# EAGLE design Example (EAGLE 9.5.2)
REVISION: 1.0; SCH_DESC: An Example Schematic; TEAM: Example_Team_Number
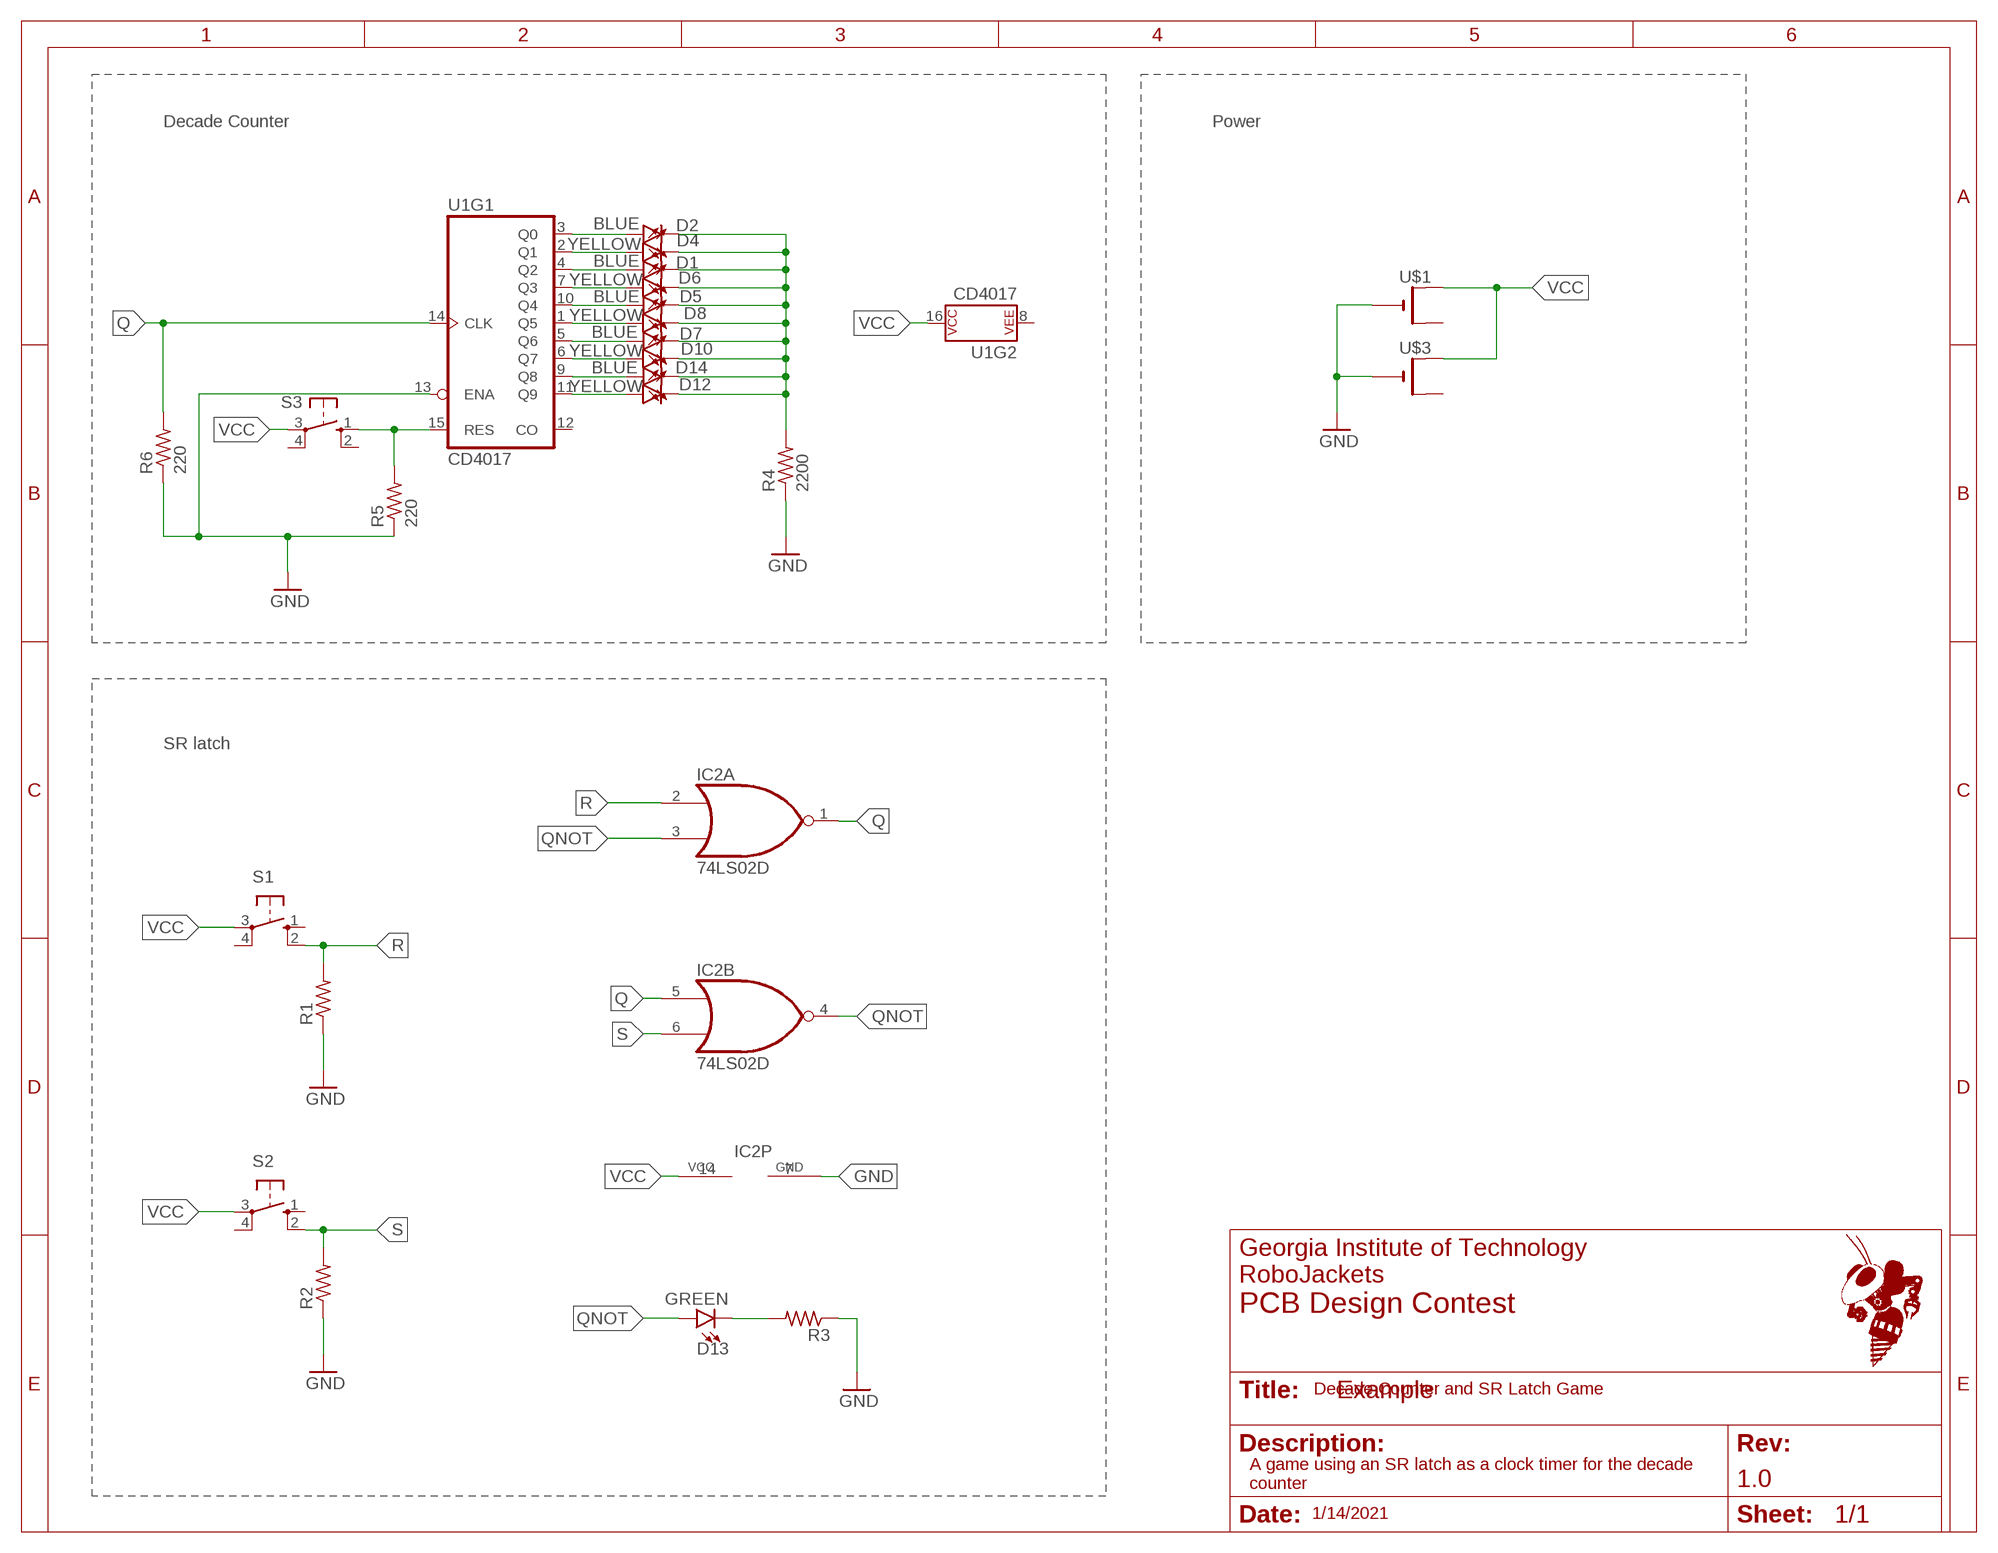
[diagram p0: schematic, sheet 1]
FRAME2 (FRAME_A_L): REVISION: 1.0; SCH_DESC: 555 Timer Motor Driver Circuit; TEAM: PCB Design Contest

## Parts
D1  BLUE  LED-BLUE0603  [LED-0603]
D2  BLUE  LED-BLUE0603  [LED-0603]
D4  YELLOW  LED-SMD-YELLOW  [LED0603]
D5  BLUE  LED-BLUE0603  [LED-0603]
D6  YELLOW  LED-SMD-YELLOW  [LED0603]
D7  BLUE  LED-BLUE0603  [LED-0603]
D8  YELLOW  LED-SMD-YELLOW  [LED0603]
D10  YELLOW  LED-SMD-YELLOW  [LED0603]
D12  YELLOW  LED-SMD-YELLOW  [LED0603]
D13  GREEN  LED-GREEN0603  [LED-0603]
D14  BLUE  LED-BLUE0603  [LED-0603]
IC2  74LS02D  [SO14]
R1  R-US_R0603  [R0603]
R2  R-US_R0603  [R0603]
R3  R-US_R0603  [R0603]
R4  2200  R-US_R0603  [R0603]
R5  220  R-US_R0603  [R0603]
R6  220  R-US_R0603  [R0603]
S1  40-XX-ROUND  [B3F-40XX-ROUND]
S2  40-XX-ROUND  [B3F-40XX-ROUND]
S3  40-XX-ROUND  [B3F-40XX-ROUND]
U1  CD4017  [DIP16]
U$1  CR1220SMT  [CR1220-SMD]
U$3  CR1220SMT  [CR1220-SMD]

## Nets
GND: IC2.7(P:GND) R1.1 R2.1 R3.1 R4.1 R5.1 R6.1 U1.13(ENA) U$1.- U$3.-
N$1: S3.3(P)
N$2: D13.A
N$3: R5.2 S3.1(S) U1.15(RES)
N$5: D13.C R3.2
N$10: D2.A U1.3(Q0)
N$11: D4.A U1.2(Q1)
N$12: D1.A U1.4(Q2)
N$13: D6.A U1.7(Q3)
N$14: D5.A U1.10(Q4)
N$15: D8.A U1.1(Q5)
N$16: D7.A U1.5(Q6)
N$17: D10.A U1.6(Q7)
N$18: D14.A U1.9(Q8)
N$19: D12.A U1.11(Q9)
N$20: D1.C D2.C D4.C D5.C D6.C D7.C D8.C D10.C D12.C D14.C R4.2
Q: IC2.1(A:O) IC2.5(B:I0) R6.2 U1.14(CLK)
QNOT: IC2.3(A:I1) IC2.4(B:O)
R: IC2.2(A:I0) R1.2 S1.2(S1)
S: IC2.6(B:I1) R2.2 S2.2(S1)
VCC: IC2.14(P:VCC) S1.3(P) S2.3(P) U1.16(P$V+) U$1.+$1(+) U$3.+$1(+)
Unconnected: IC2.8(C:I0) IC2.9(C:I1) IC2.10(C:O) IC2.11(D:I0) IC2.12(D:I1) IC2.13(D:O) S1.1(S) S1.4(P1) S2.1(S) S2.4(P1) S3.2(S1) S3.4(P1) U1.8(P$V-) U1.12(CO) U$1.+$2(+1) U$3.+$2(+1)

## Notes on the sheet
- Decade Counter | Power
- SR latch
- Decade Counter and SR Latch Game
- A game using an SR latch as a clock timer for the decade 
  counter
- 1/14/2021

## Library data of the parts
D1 D2 D5 D7 D14 = RoboJackets-LEDs:LED-BLUE: Blue SMD LED Used in manufacturing of various products at SparkFun Packages: 0603 - SMD 0603 package [Product Link] <http://www.digikey.com/product-detail/en/SMLE12BC7TT86/511-1589-2-ND/1641808> 1206 - SMD1206 package [Product Link] <http://www.digikey.com/product-detail/en/lite-on-inc/LTST-C150TBKT/160-1643-1-ND/573584> SparkFun Products: ESP8266 Thing-Dev Board <https://www.sparkfun.com/products/13711> RedBoard <https://www.sparkfun.com/products/12757>; PROD_ID: DIO-08575
D4 D6 D8 D10 D12 = RoboJackets-LEDs:LED-SMD: Series of 0603 LEDs; DKPN: 160-1448-1-ND
D13 = RoboJackets-LEDs:LED-GREEN: Green SMD LED Used in manufacturing of various products at SparkFun Packages: 0603 - SMD 0603 package [Product Link] <http://www.futureelectronics.com/en/technologies/semiconductors/optoelectronics/leds/Pages/9894312-LTST-C190GKT.aspx?CrossPart=HSMG-C190&IM=0> LilyPad 1206 - SMD1206 LilyPad package [Product Link] <http://www.futureelectronics.com/en/Technologies/Product.aspx?ProductID=IN150NGHARVATEKCORPORATION2049943&IM=0> 1206 - SMD1206 package [Product Link] <http://www.futureelectronics.com/en/technologies/semiconductors/optoelectronics/leds/Pages/8315665-LTST-C150KGKT.aspx?IM=0> 1206 Bottom Mount -SMD 1206 Bottom Mount [Product Link] <http://www.digikey.com/product-detail/en/lite-on-inc/LTST-C230KGKT/160-1456-1-ND/386854> SparkFun Products: Pro Mini 328 -5V <https://www.sparkfun.com/products/821> RedBoard <https://www.sparkfun.com/products/12757> MP3 Trigger <https://www.sparkfun.com/products/13720> Makey Makey <https://www.sparkfun.com/products/11076>; PROD_ID: DIO-00821
IC2 = 74xx-us:74*02: Quad 2-input NOR gate; SPICEPREFIX: J
R1-R6 = rcl:R-US_: RESISTOR, American symbol; SPICEPREFIX: R
S1-S3 = adafruit:40-XX: OMRON SWITCH
U1 = SparkFun-IC-Logic:CD4017: 10-Out Decade Counter Datasheet <https://cdn.sparkfun.com/datasheets/Kits/cd4022b.pdf> SparkFun Products SparkFun SparkPunk Sequencer Kit <https://www.sparkfun.com/products/12707> (KIT-12707); PROD_ID: IC-11929
U$1 U$3 = adafruit:CR1220: CR1216/CR1220/CR1225 12mm 3V lithium coin cell Great for battery packup. Both SMT and THM holders. Note the THM package has the ground pads on both sides of the PCB so that the masks are the same - this reduces the cost

## Board
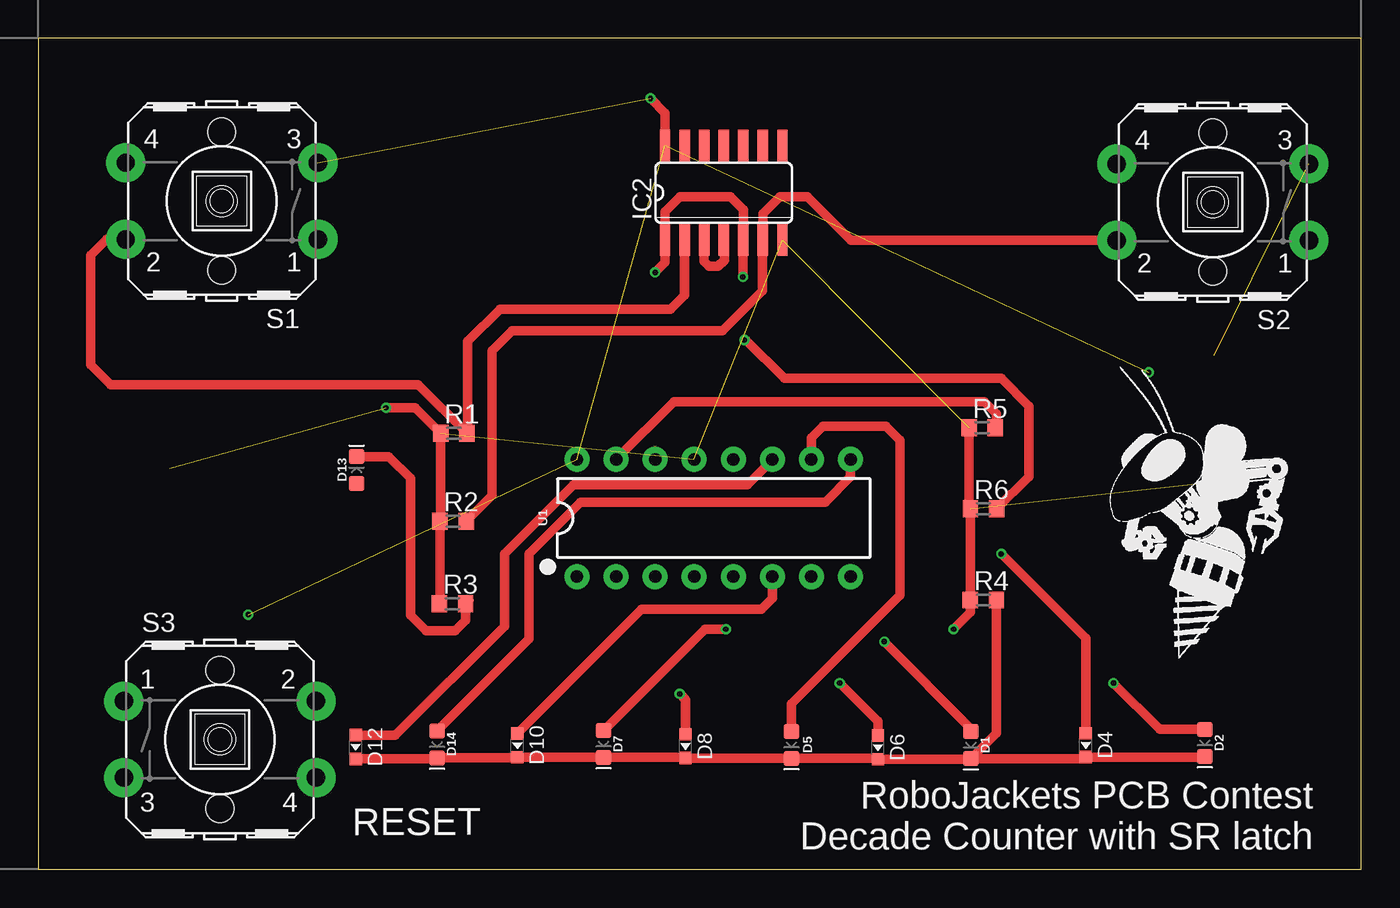
[diagram p1: board, top side]
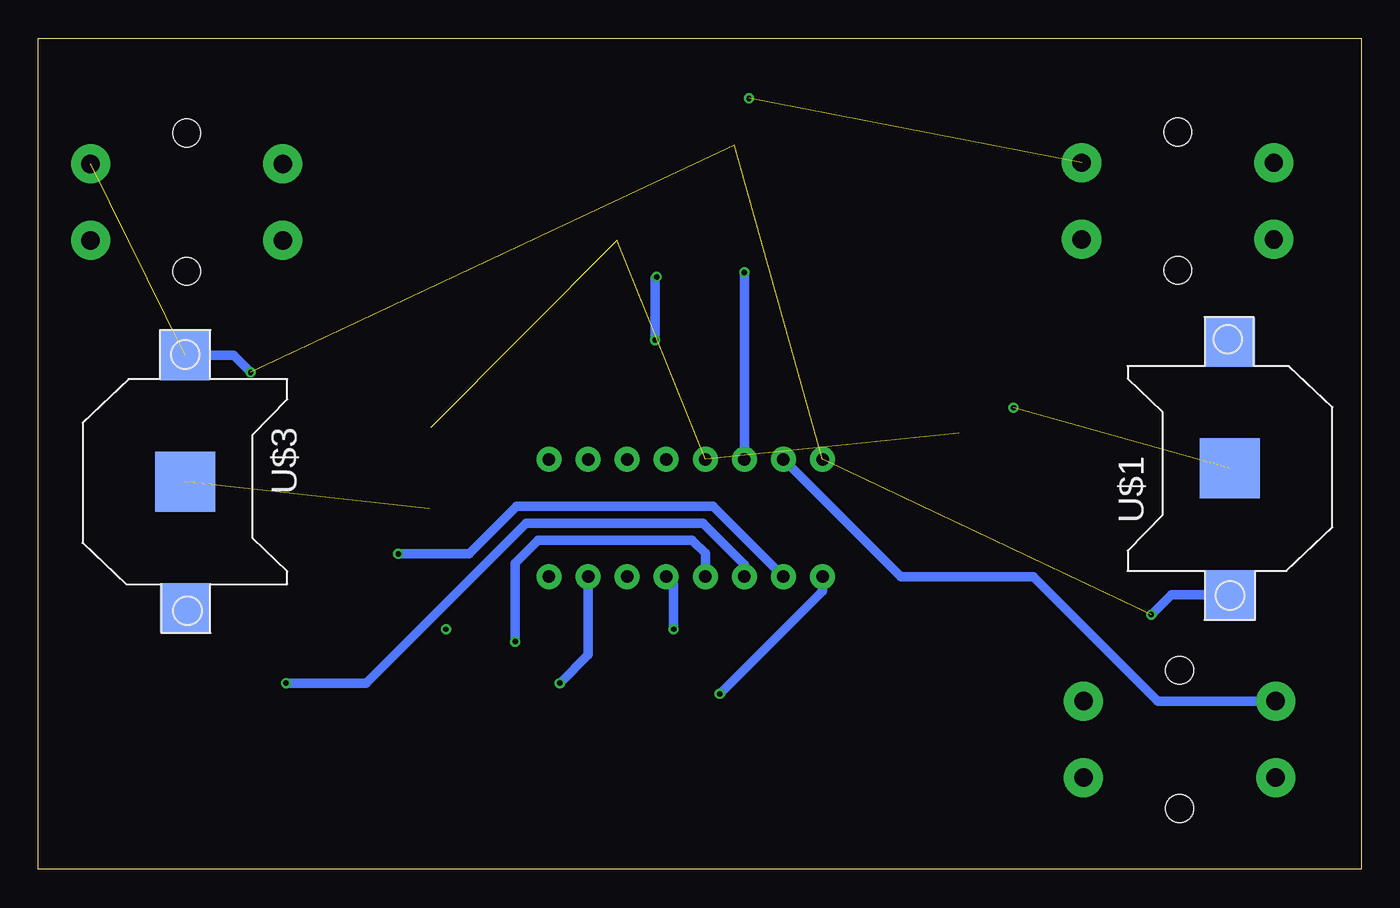
[diagram p2: board, bottom side, seen from below]

Size 86 x 54 mm. Coordinates in mm from the lower left corner, seen from the top.
Outline: 0,0 86,0 86,54 0,54 0,0
Copper layers (1*16): Top 0.035mm / dielectric 1.53mm / Bottom 0.035mm
Design rules "JLCPCB (2 Layer)": minimum track width 5mil, minimum drill 0.3mm, track to track 5mil, track to pad 5mil, pad to pad 5mil, via to via 20mil, smd to smd 5mil, copper to edge 0.2mm, drill to drill 21mil, minimum pad ring 6mil, minimum via ring 6mil, stop-mask expansion 0.05mm, vias tented up to drill 30mil, thermal gap 10mil

### Footprints (pad centres in the part's own frame; a part is rotated, then mirrored left to right if it is on the bottom)
LED-0603 = smd 1 x 1: A -0.877,0; C 0.877,0
LED0603 = smd 0.8 x 0.8: A -0.775,0; C 0.775,0
SO14 = smd 0.66 x 2.032: 1 -3.81,-3.073; 2 -2.54,-3.073; 3 -1.27,-3.073; 4 0,-3.073; 5 1.27,-3.073; 6 2.54,-3.073; 7 3.81,-3.073; 8 3.81,3.073; 9 2.54,3.073; 10 1.27,3.073; 11 0,3.073; 12 -1.27,3.073; 13 -2.54,3.073; 14 -3.81,3.073
R0603 = smd 1 x 1.1: 1 -0.85,0; 2 0.85,0
B3F-40XX-ROUND = drill 1.194 pad 2.54: 1 -6.248,2.489; 2 6.248,2.489; 3 -6.248,-2.489; 4 6.248,-2.489 | hole 1.803: 0,-4.496; 0,4.496
DIP16 = drill 0.813 pad 1.626: 1 -8.89,-3.81; 2 -6.35,-3.81; 3 -3.81,-3.81; 4 -1.27,-3.81; 5 1.27,-3.81; 6 3.81,-3.81; 7 6.35,-3.81; 8 8.89,-3.81; 9 8.89,3.81; 10 6.35,3.81; 11 3.81,3.81; 12 1.27,3.81; 13 -1.27,3.81; 14 -3.81,3.81; 15 -6.35,3.81; 16 -8.89,3.81
CR1220-SMD = smd 3.2 x 3.2: +$1 -8.2,0; +$2 8.2,0 | smd 3.9 x 3.9: - 0,0

### Placement (x,y rotation side)
D1  60.63,8.07 270 top
D2  75.84,8.21 270 top
D4  68.1,8.07 270 top
D5  48.96,8.08 270 top
D6  54.59,7.92 270 top
D7  36.75,8.14 270 top
D8  42.07,8 270 top
D10  31.14,8.05 270 top
D12  20.63,7.95 270 top
D13  20.69,25.95 90 top
D14  25.92,8.11 270 top
IC2  44.56,43.97 0 top
R1  27.01,28.34 0 top
R2  26.96,22.63 0 top
R3  26.92,17.27 0 top
R4  61.44,17.5 0 top
R5  61.36,28.69 0 top
R6  61.45,23.42 0 top
S1  11.92,43.43 180 top
S2  76.36,43.36 180 top
S3  11.8,8.44 0 top
U1  43.91,22.83 0 top
U$1  8.52,26.05 90 bottom
U$3  76.47,25.2 270 bottom
U$4  [ROBOBUZZ_1.0X]  74.1,13.7 0 top

### Tracks (layer width: path | path; a pad name or v marks a point on that pad's centre or on a via)
GND  (via drill 0.35)  (5 unrouted)
  Top 0.152: 26.16,22.68 R2.1 | 26.11,17.31 R3.1 | 60.51,23.51 R6.1 | R4.1
  Top 0.61: 26.16,22.68 R1.1 24.5,30 v22.6,30 | R2.1 26.11,17.31 | R5.1 60.51,23.51 | R4.1 R6.1 | R4.1 60.59,16.69 v59.5,15.6
N$3
  Top 0.152: S3.1 5.52,10.9
  Top 0.61: U1.15 41.32,30.4 61.5,30.4 62.3,29.6 62.3,28.78 R5.2
  Bottom 0.61: U1.15 29.92,19 21.3,19 13.23,10.93 S3.1
N$5
  Top 0.61: 28,17.5 R3.2 27.77,16.17 27.1,15.5 25.2,15.5 24.2,16.5 24.2,25.4 22.77,26.83 D13.C
N$10  (via drill 0.35)
  Top 0.61: D2.A 72.91,9.09 v69.9,12.1
  Bottom 0.61: v69.9,12.1 64.7,12.1 54.3,22.5 42.8,22.5 40.1,19.8 U1.3
N$11  (via drill 0.35)
  Top 0.61: D4.A 68.1,15 v62.6,20.5
  Bottom 0.61: v62.6,20.5 58,20.5 54.9,23.6 42.14,23.6 U1.2
N$12  (via drill 0.35)
  Top 0.61: D1.A 60.63,9.15 55,14.78 v55,14.8
  Bottom 0.61: v55,14.8 55,19.9 53.5,21.4 43.5,21.4 42.64,20.54 U1.4
N$13  (via drill 0.35)
  Top 0.61: D6.A 54.59,9.61 v52.1,12.1
  Bottom 0.61: v52.1,12.1 50.26,13.94 U1.7
N$14
  Top 0.61: D5.A 48.96,10.76 56,17.8 56,27.9 55.1,28.8 51,28.8 50.26,28.06 U1.10
N$15  (via drill 0.35)
  Top 0.61: D8.A 42.07,11.03 v41.7,11.4
  Bottom 0.61: v41.7,11.4 35.02,18.08 U1.1
N$16  (via drill 0.35)
  Top 0.61: D7.A 43.33,15.6 v44.7,15.6
  Bottom 0.61: v44.7,15.6 44.7,18.54 U1.5
N$17
  Top 0.61: 31.2,8.88 D10.A 39.22,16.9 47,16.9 47.72,17.62 U1.6
N$18
  Top 0.61: D14.A 31.9,14.97 31.9,20.5 35.26,23.86 51.16,23.86 52.8,25.5 U1.9
N$19
  Top 0.61: U1.11 47.72,26.62 46.1,25 34.8,25 30.3,20.5 30.3,15.8 23.2,8.7 20.66,8.7 D12.A
N$20
  Top 0.152: 25.86,7.17 D14.C | 31.1,7.23 D10.C | 36.74,7.28 D7.C | 42.03,7.26 D8.C | 48.94,7.22 D5.C | 54.53,7.2 D6.C | 60.58,7.14 D1.C | 68,7.19 D4.C | 75.8,7.29 D2.C
  Top 0.61: D12.C 25.86,7.17 | D14.C 31.1,7.23 | D10.C 36.74,7.28 | D7.C 42.03,7.26 | D8.C 48.94,7.22 | D5.C 54.53,7.2 | D6.C 60.58,7.14 | 68,7.19 D1.C 62.29,8.85 R4.2 | D4.C 75.8,7.29
Q  (via drill 0.35)
  Top 0.61: 40.1,27.2 U1.14 | v40.1,38.8 40.75,39.45 IC2.1 40.75,42.75 41.7,43.7 45,43.7 45.83,42.87 IC2.5 45.8,40.87 v45.8,38.5 | R6.2 64.4,25.52 64.4,30.1 62.6,31.9 48.5,31.9 46,34.4 v45.9,34.4
  Bottom 0.61: v40.1,38.8 U1.14 | v45.9,34.4 45.9,38.4 v45.8,38.5
QNOT
  Top 0.61: IC2.3 43.29,39.51 43.6,39.2 44.2,39.2 44.6,39.6 44.6,40.86 IC2.4
R
  Top 0.152: 27.91,28.39 R1.2
  Top 0.61: S1.2 4.44,40.94 3.4,39.9 3.4,32.8 4.7,31.5 24.7,31.5 R1.2 | IC2.2 42.02,37.32 41.1,36.4 30,36.4 27.91,34.31 27.91,28.39
S
  Top 0.61: S2.2 52.83,40.87 50,43.7 48.2,43.7 47.1,42.6 IC2.6 47.09,37.6 44.49,35 30.8,35 29.5,33.7 29.5,24.32 R2.2
VCC  (via drill 0.35)  (5 unrouted)
  Top 0.61: IC2.14 40.75,49.15 v39.8,50.1
  Bottom 0.61: U$1.+$1 12.35,17.85 v13.65,16.55 | U$3.+$1 73.3,33.4 v72.2,32.3

### Text on the board
tPlace: RoboJackets PCB Contest / Decade Counter with SR latch | RESET